# Altium schematic sheet MCH_FPGA_GND_NC.SchDoc: Metlino
size 420 x 297 mm; CheckedBy: P.Kulik,T.Przywozki,W.Ruclo; Author: G.Kasprowicz; CompanyName: WUT ISE; DrawnBy: G.Kasprowicz; Organization: WUT ISE; Address1: PW ISE; Address2: Nowowiejska 15/19 00-665 Warsaw; Address3: gkasprow@gmail.com; DocumentNumber: 10; Revision: 2; SheetNumber: 10; SheetTotal: 29; ModifiedBy: -; CheckedDate: -; Title2: FPGA - GND & DNC pins; DivGrp: WUT ISE; Designer: G.Kasprowicz; ModifiedDate: -; ProjectName: Sensor Box
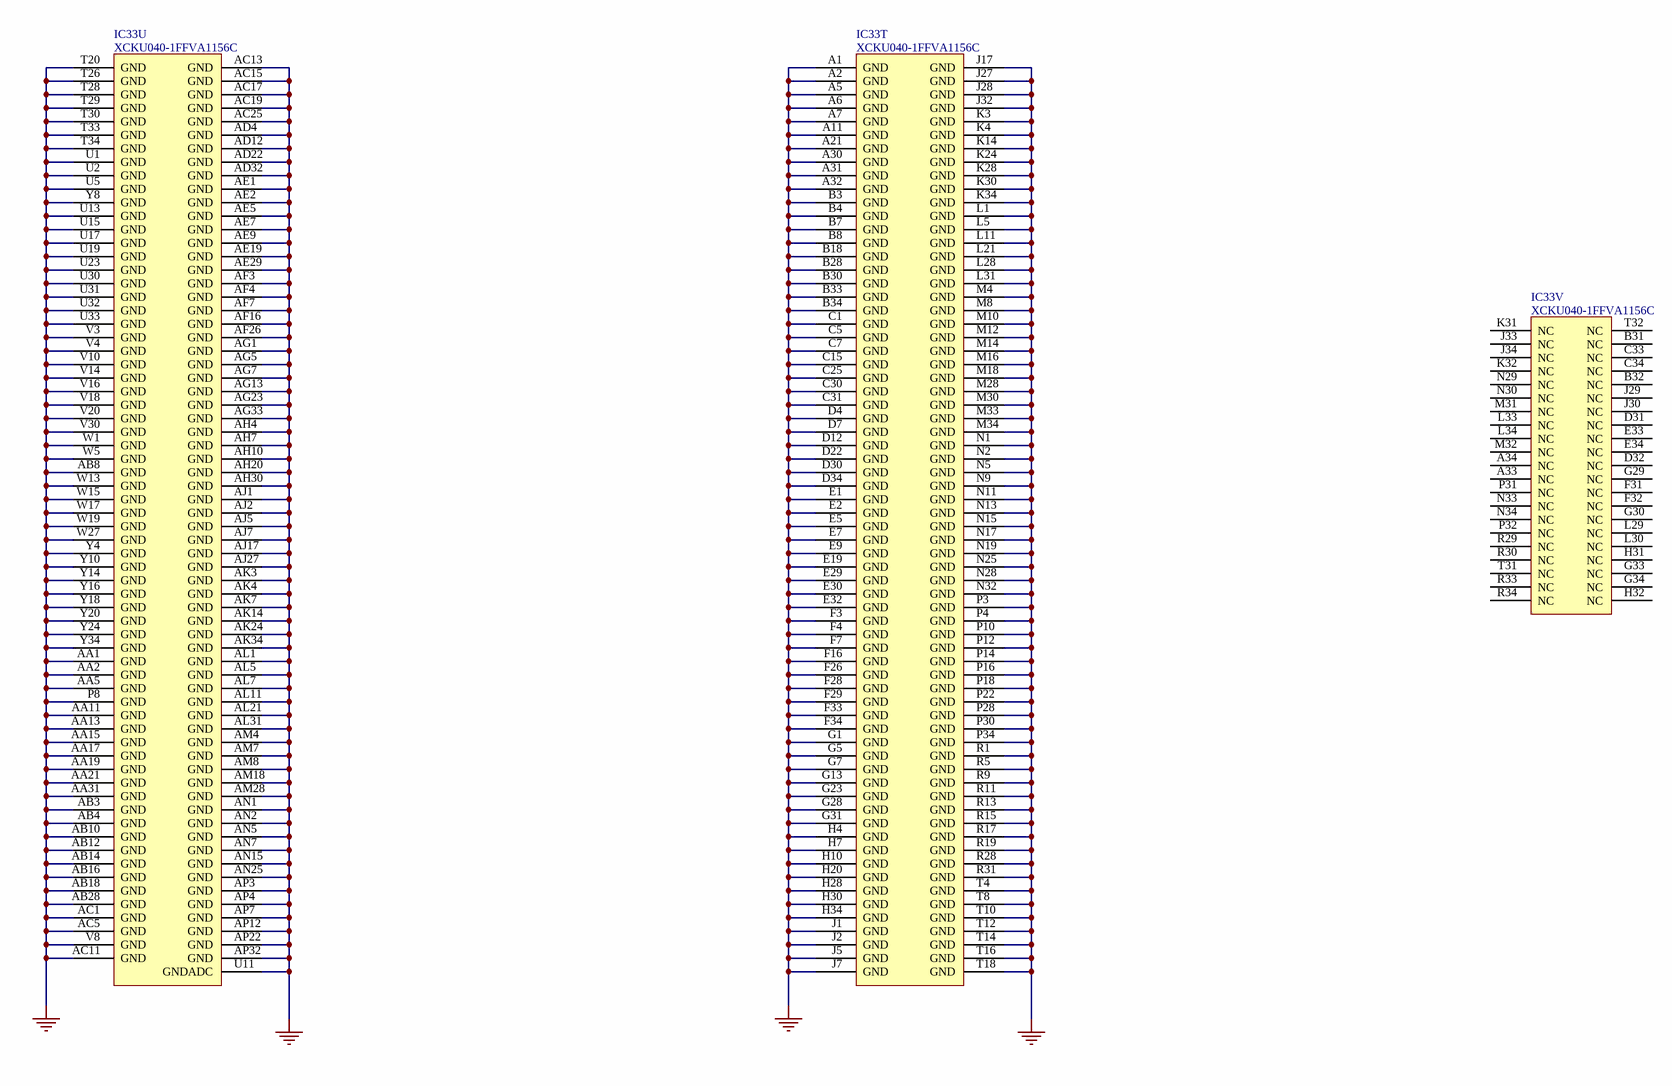
[diagram p0: MCH_FPGA_GND_NC.SchDoc]

## Parts
IC33  XCKU040-1FFVA1156C  [BGA1156C100P34X34_3500X3500X350]  (parts T,U,V of 22)

## Nets
GND: IC33.A1(GND) IC33.A2(GND) IC33.A5(GND) IC33.A6(GND) IC33.A7(GND) IC33.A11(GND) IC33.A21(GND) IC33.A30(GND) IC33.A31(GND) IC33.A32(GND) IC33.AA1(GND) IC33.AA2(GND) IC33.AA5(GND) IC33.AA11(GND) IC33.AA13(GND) IC33.AA15(GND) IC33.AA17(GND) IC33.AA19(GND) IC33.AA21(GND) IC33.AA31(GND) IC33.AB3(GND) IC33.AB4(GND) IC33.AB8(GND) IC33.AB10(GND) IC33.AB12(GND) IC33.AB14(GND) IC33.AB16(GND) IC33.AB18(GND) IC33.AB28(GND) IC33.AC1(GND) IC33.AC5(GND) IC33.AC11(GND) IC33.AC13(GND) IC33.AC15(GND) IC33.AC17(GND) IC33.AC19(GND) IC33.AC25(GND) IC33.AD4(GND) IC33.AD12(GND) IC33.AD22(GND) IC33.AD32(GND) IC33.AE1(GND) IC33.AE2(GND) IC33.AE5(GND) IC33.AE7(GND) IC33.AE9(GND) IC33.AE19(GND) IC33.AE29(GND) IC33.AF3(GND) IC33.AF4(GND) IC33.AF7(GND) IC33.AF16(GND) IC33.AF26(GND) IC33.AG1(GND) IC33.AG5(GND) IC33.AG7(GND) IC33.AG13(GND) IC33.AG23(GND) IC33.AG33(GND) IC33.AH4(GND) IC33.AH7(GND) IC33.AH10(GND) IC33.AH20(GND) IC33.AH30(GND) IC33.AJ1(GND) IC33.AJ2(GND) IC33.AJ5(GND) IC33.AJ7(GND) IC33.AJ17(GND) IC33.AJ27(GND) IC33.AK3(GND) IC33.AK4(GND) IC33.AK7(GND) IC33.AK14(GND) IC33.AK24(GND) IC33.AK34(GND) IC33.AL1(GND) IC33.AL5(GND) IC33.AL7(GND) IC33.AL11(GND) IC33.AL21(GND) IC33.AL31(GND) IC33.AM4(GND) IC33.AM7(GND) IC33.AM8(GND) IC33.AM18(GND) IC33.AM28(GND) IC33.AN1(GND) IC33.AN2(GND) IC33.AN5(GND) IC33.AN7(GND) IC33.AN15(GND) IC33.AN25(GND) IC33.AP3(GND) IC33.AP4(GND) IC33.AP7(GND) IC33.AP12(GND) IC33.AP22(GND) IC33.AP32(GND) IC33.B3(GND) IC33.B4(GND) IC33.B7(GND) IC33.B8(GND) IC33.B18(GND) IC33.B28(GND) IC33.B30(GND) IC33.B33(GND) IC33.B34(GND) IC33.C1(GND) IC33.C5(GND) IC33.C7(GND) IC33.C15(GND) IC33.C25(GND) IC33.C30(GND) IC33.C31(GND) IC33.D4(GND) IC33.D7(GND) IC33.D12(GND) IC33.D22(GND) IC33.D30(GND) IC33.D34(GND) IC33.E1(GND) IC33.E2(GND) IC33.E5(GND) IC33.E7(GND) IC33.E9(GND) IC33.E19(GND) IC33.E29(GND) IC33.E30(GND) IC33.E32(GND) IC33.F3(GND) IC33.F4(GND) IC33.F7(GND) IC33.F16(GND) IC33.F26(GND) IC33.F28(GND) IC33.F29(GND) IC33.F33(GND) IC33.F34(GND) IC33.G1(GND) IC33.G5(GND) IC33.G7(GND) IC33.G13(GND) IC33.G23(GND) IC33.G28(GND) IC33.G31(GND) IC33.H4(GND) IC33.H7(GND) IC33.H10(GND) IC33.H20(GND) IC33.H28(GND) IC33.H30(GND) IC33.H34(GND) IC33.J1(GND) IC33.J2(GND) IC33.J5(GND) IC33.J7(GND) IC33.J17(GND) IC33.J27(GND) IC33.J28(GND) IC33.J32(GND) IC33.K3(GND) IC33.K4(GND) IC33.K14(GND) IC33.K24(GND) IC33.K28(GND) IC33.K30(GND) IC33.K34(GND) IC33.L1(GND) IC33.L5(GND) IC33.L11(GND) IC33.L21(GND) IC33.L28(GND) IC33.L31(GND) IC33.M4(GND) IC33.M8(GND) IC33.M10(GND) IC33.M12(GND) IC33.M14(GND) IC33.M16(GND) IC33.M18(GND) IC33.M28(GND) IC33.M30(GND) IC33.M33(GND) IC33.M34(GND) IC33.N1(GND) IC33.N2(GND) IC33.N5(GND) IC33.N9(GND) IC33.N11(GND) IC33.N13(GND) IC33.N15(GND) IC33.N17(GND) IC33.N19(GND) IC33.N25(GND) IC33.N28(GND) IC33.N32(GND) IC33.P3(GND) IC33.P4(GND) IC33.P8(GND) IC33.P10(GND) IC33.P12(GND) IC33.P14(GND) IC33.P16(GND) IC33.P18(GND) IC33.P22(GND) IC33.P28(GND) IC33.P30(GND) IC33.P34(GND) IC33.R1(GND) IC33.R5(GND) IC33.R9(GND) IC33.R11(GND) IC33.R13(GND) IC33.R15(GND) IC33.R17(GND) IC33.R19(GND) IC33.R28(GND) IC33.R31(GND) IC33.T4(GND) IC33.T8(GND) IC33.T10(GND) IC33.T12(GND) IC33.T14(GND) IC33.T16(GND) IC33.T18(GND) IC33.T20(GND) IC33.T26(GND) IC33.T28(GND) IC33.T29(GND) IC33.T30(GND) IC33.T33(GND) IC33.T34(GND) IC33.U1(GND) IC33.U2(GND) IC33.U5(GND) IC33.U11(GNDADC) IC33.U13(GND) IC33.U15(GND) IC33.U17(GND) IC33.U19(GND) IC33.U23(GND) IC33.U30(GND) IC33.U31(GND) IC33.U32(GND) IC33.U33(GND) IC33.V3(GND) IC33.V4(GND) IC33.V8(GND) IC33.V10(GND) IC33.V14(GND) IC33.V16(GND) IC33.V18(GND) IC33.V20(GND) IC33.V30(GND) IC33.W1(GND) IC33.W5(GND) IC33.W13(GND) IC33.W15(GND) IC33.W17(GND) IC33.W19(GND) IC33.W27(GND) IC33.Y4(GND) IC33.Y8(GND) IC33.Y10(GND) IC33.Y14(GND) IC33.Y16(GND) IC33.Y18(GND) IC33.Y20(GND) IC33.Y24(GND) IC33.Y34(GND)

Not connected (* = marked no-connect by the designer): IC33 A33(NC) A34(NC) B31(NC) B32(NC) C33(NC) C34(NC) D31(NC) D32(NC) E33(NC) E34(NC) F31(NC) F32(NC) G29(NC) G30(NC) G33(NC) G34(NC) H31(NC) H32(NC) J29(NC) J30(NC) J33(NC) J34(NC) K31(NC) K32(NC) L29(NC) L30(NC) L33(NC) L34(NC) M31(NC) M32(NC) N29(NC) N30(NC) N33(NC) N34(NC) P31(NC) P32(NC) R29(NC) R30(NC) R33(NC) R34(NC) T31(NC) T32(NC)

## Notes on the sheet
- Project/Equipment
- Document
- Designer
- Drawn by
- Check.by
- Copyright WUT ISE 2018.
  This documentation describes Open Hardware and is licensed under the CERN OHL v.1.1. You may redistribute and modify this documentation under the terms of the CERN OHL v.1.1. (http://ohwr.org/CERNOHL). This documentation is distributed WITHOUT ANY EXPRESS OR IMPLIED WARRANTY, INCLUDING OF MERCHANTABILITY, SATISFACTORY QUALITY AND FITNESS FOR A PARTICULAR PURPOSE. Please see the CERN OHL v.1.1 for applicable conditions.
- Contact
- File
- Last Mod.
- Print Date
- Sheet
- Size
- A3
- of
- Rev

## Library data of the parts
IC33 = XCKU040-1FFVA1156C: Kintex UltraScale FPGA, 520 I/O, 530K Cells, 1156-Ball BGA, Speed Grade 1, Commercial Grade; Manufacturer: XILINX; Part Description: Kintex UltraScale, 40 DLL I/O, 416 HP I/O, 104 HR I/O, 1156-Pin BGA, Speed Grade 1, Commercial Grade; PressFit: No; Bonding: No; Manufacturer Part Number: XCKU040-1FFVA1156C; PackageDescription: BGA, 1.00mm Pitch, Square; 1156 Pin, 34 Columns X 34 Rows, Body 35.00mm X 35.00mm X 3.50mm H, IPC Medium Density; Part Number: XCKU040-1FFVA1156C; Component Kind: Standard; Component Type: Standard; Device: XCKU040-1FFVA1156C; Pin Count: 1156; Case: BGA1156; Mounted: Yes; Socket: No; SMD: Yes; Sense: No; ComponentHeight: 3.5mm; HelpURL: \\cern.ch\dfs\Applications\Altium\Datasheets\XCKU040-1FFVA1156C.pdf; ComponentLink1URL: \\cern.ch\dfs\Applications\Altium\Datasheets\XCKU040-1FFVA1156C_Package-Pinout.pdf; ComponentLink1Description: Package/Pinout; Author: CERN DEM CA; CreateDate: 16.08.2016; LatestRevisionDate: 16.08.2016